# Altium schematic sheet 34-SERDES AND DISPLAY INTERFACE.SchDoc
size 513 x 386 mm
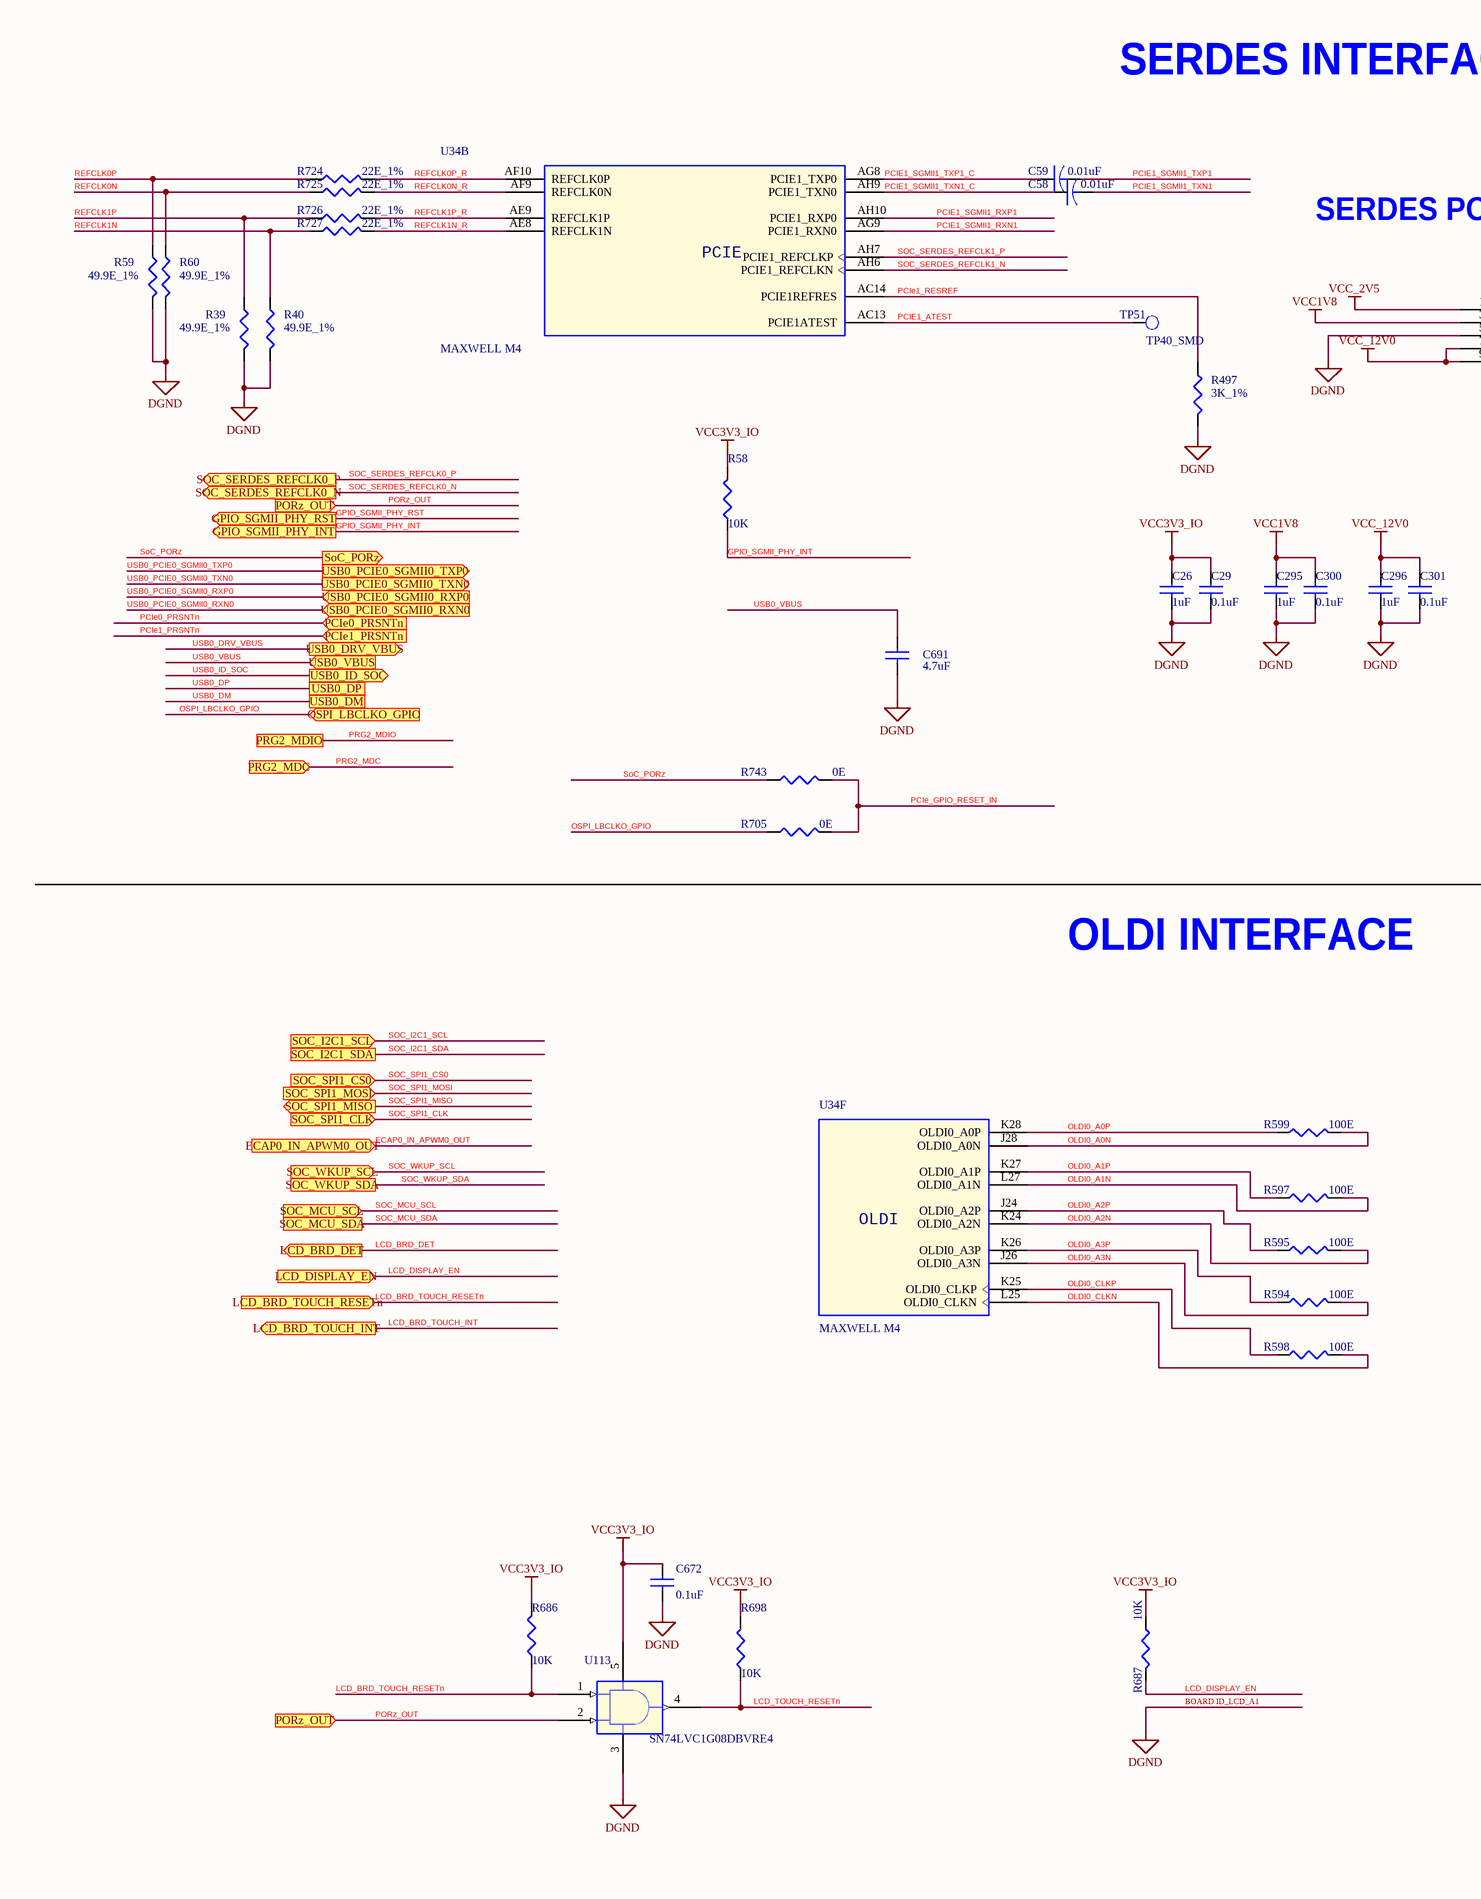
[diagram p0: 34-SERDES AND DISPLAY INTERFACE.SchDoc, left]
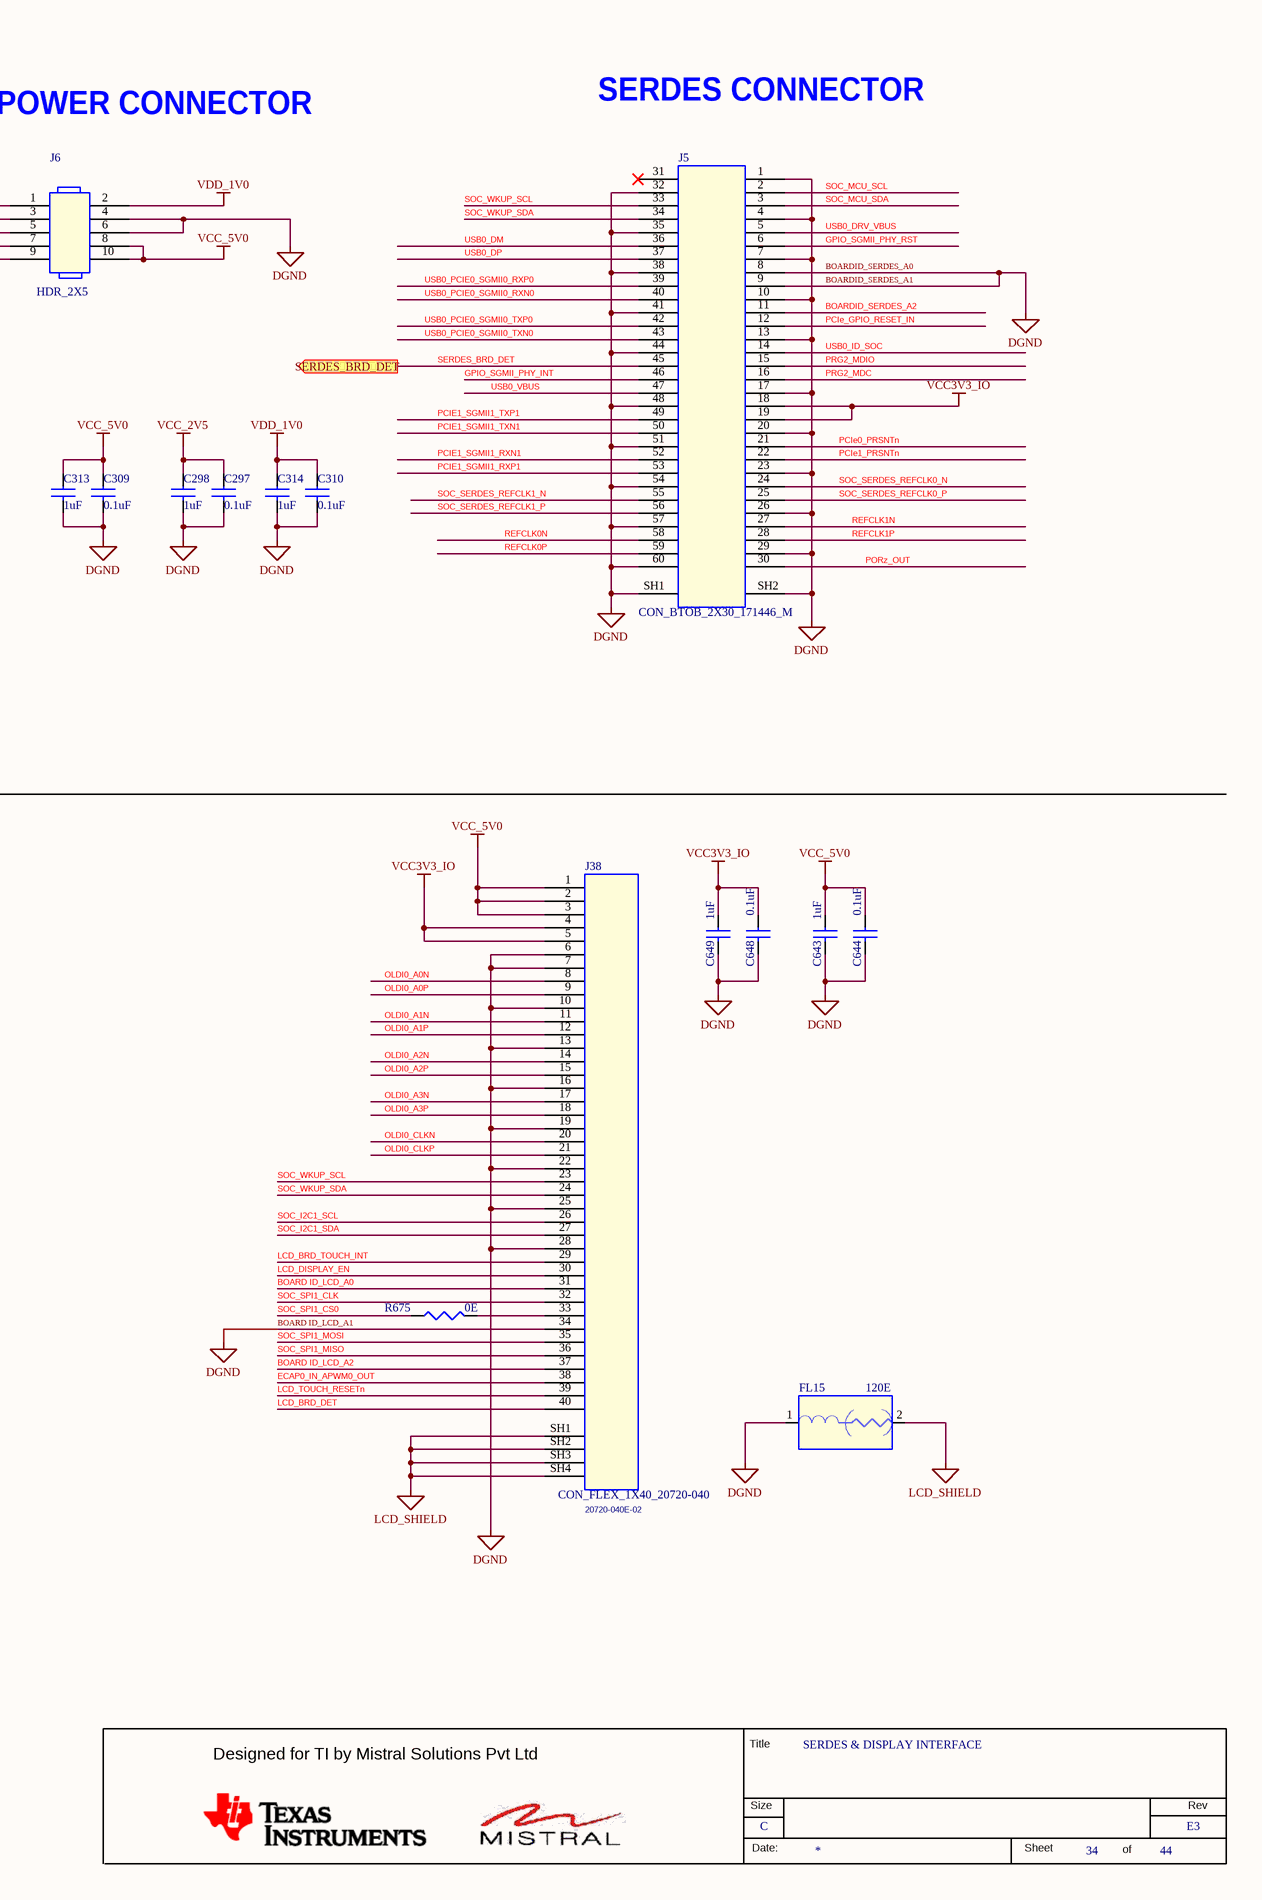
[diagram p1: 34-SERDES AND DISPLAY INTERFACE.SchDoc, right]

## Parts
*  RevCode: E3  Title: SERDES & DISPLAY INTERFACE  Page Size: C  Page Number: 34  Page Count: 44  (hidden comment: MISTRAL_TITLEBLK_CSIZE)  (graphical)
C26  1uF  [CAP0402_0-75]
C29  0.1uF  [CAP0201_0-5]
C58  0.01uF  [CAP0402_0-75]
C59  0.01uF  [CAP0402_0-75]
C295  1uF  [CAP0402_0-75]
C296  1uF  [CAP0402_0-75]
C297  0.1uF  [CAP0201_0-5]
C298  1uF  [CAP0402_0-75]
C300  0.1uF  [CAP0201_0-5]
C301  0.1uF  [CAP0201_0-5]
C309  0.1uF  [CAP0201_0-5]
C310  0.1uF  [CAP0201_0-5]
C313  1uF  [CAP0402_0-75]
C314  1uF  [CAP0402_0-75]
C643  1uF  [CAP0402_0-75]
C644  0.1uF  [CAP0201_0-5]
C648  0.1uF  [CAP0201_0-5]
C649  1uF  [CAP0402_0-75]
C672  0.1uF  [CAP0201_0-5]
C691  4.7uF  [CAP0402_0-75]
FL15  120E  [EMIFIL_BLM15A_0402_0-6]
J5  CON_BTOB_2X30_171446_M  [CON_BTOB2X30_171446_P_S_S_5-5]
J6  HDR_2X5  [HDR_2X5_TFC-105-01-D-A_S_T_5-6]
J38  CON_FLEX_1X40_20720-040  Mfr_part_number: 20720-040E-02  [CON_FLEX1X40_20720-040_S_R_S_2]
R39  49.9E_1%  [RES0201]
R40  49.9E_1%  [RES0201]
R58  10K  [RES0402_0-5]
R59  49.9E_1%  [RES0201]
R60  49.9E_1%  [RES0201]
R497  3K_1%  [RES0402_0-5]
R594  100E  [RES0201]
R595  100E  [RES0201]
R597  100E  [RES0201]
R598  100E  [RES0201]
R599  100E  [RES0201]
R675  0E  [RES0402_0-5]
R686  10K  [RES0402_0-5]
R687  10K  [RES0402_0-5]
R698  10K  [RES0402_0-5]
R705  0E  [RES0402_0-5]
R724  22E_1%  [RES0402]
R725  22E_1%  [RES0402]
R726  22E_1%  [RES0402]
R727  22E_1%  [RES0402]
R743  0E  [RES0402_0-5]
TP51  TP40_SMD  [TP40_SMD]
U34  MAXWELL M4  [BGA784_31-49_910X910_1-7]  (parts B,F of 19)
U113  SN74LVC1G08DBVRE4  [SOT23-5]

## Ports
ECAP0_IN_APWM0_OUT (in), GPIO_SGMII_PHY_INT (out), GPIO_SGMII_PHY_RST (out), LCD_BRD_DET (out), LCD_BRD_TOUCH_INT (out), LCD_BRD_TOUCH_RESETn (in), LCD_DISPLAY_EN (in), OSPI_LBCLKO_GPIO (in), PCIe0_PRSNTn (in), PCIe1_PRSNTn (in), PORz_OUT (in), PRG2_MDC (in), PRG2_MDIO, SERDES_BRD_DET (out), SOC_I2C1_SCL (in), SOC_I2C1_SDA, SOC_MCU_SCL (in), SOC_MCU_SDA, SoC_PORz (out), SOC_SERDES_REFCLK0_N (out), SOC_SERDES_REFCLK0_P (out), SOC_SPI1_CLK (in), SOC_SPI1_CS0 (in), SOC_SPI1_MISO (out), SOC_SPI1_MOSI (in), SOC_WKUP_SCL (in), SOC_WKUP_SDA, USB0_DM, USB0_DP, USB0_DRV_VBUS (out), USB0_ID_SOC (out), USB0_PCIE0_SGMII0_RXN0 (in), USB0_PCIE0_SGMII0_RXP0 (in), USB0_PCIE0_SGMII0_TXN0 (out), USB0_PCIE0_SGMII0_TXP0 (out), USB0_VBUS (in)

## Nets
DGND: C26.2 C29.2 C295.2 C296.2 C297.2 C298.2 C300.2 C301.2 C309.2 C310.2 C313.2 C314.2 C643.2 C644.2 C648.2 C649.2 C672.2 C691.2 FL15.1 J5.1 J5.4 J5.7 J5.8 J5.9 J5.10 J5.13 J5.17 J5.20 J5.23 J5.26 J5.29 J5.32 J5.35 J5.38 J5.41 J5.44 J5.48 J5.51 J5.54 J5.57 J5.60 J5.SH1 J5.SH2 J6.4 J6.5 J6.6 J38.6 J38.7 J38.10 J38.13 J38.16 J38.19 J38.22 J38.25 J38.28 J38.34 R39.2 R40.2 R59.2 R60.2 R497.2 U113.3(GND)
LCD_SHIELD: FL15.2 J38.SH1 J38.SH2 J38.SH3 J38.SH4
VCC1V8: C295.1 C300.1 J6.3
VCC3V3_IO: C26.1 C29.1 C648.1 C649.1 C672.1 J5.18 J5.19 J38.4 J38.5 R58.2 R686.2 R687.1 R698.2 U113.5(VCC)
VCC_2V5: C297.1 C298.1 J6.1
VCC_5V0: C309.1 C313.1 C643.1 C644.1 J6.8 J6.10 J38.1 J38.2 J38.3
VCC_12V0: C296.1 C301.1 J6.7 J6.9
VDD_1V0: C310.1 C314.1 J6.2
BOARD ID_LCD_A0: J38.31
BOARD ID_LCD_A2: J38.37
BOARDID_SERDES_A2: J5.11
ECAP0_IN_APWM0_OUT: J38.38 ; port ECAP0_IN_APWM0_OUT
GPIO_SGMII_PHY_INT: J5.46 R58.1 ; port GPIO_SGMII_PHY_INT
GPIO_SGMII_PHY_RST: J5.6 ; port GPIO_SGMII_PHY_RST
LCD_BRD_DET: J38.40 ; port LCD_BRD_DET
LCD_BRD_TOUCH_INT: J38.29 ; port LCD_BRD_TOUCH_INT
LCD_BRD_TOUCH_RESETn: R686.1 U113.1(A) ; port LCD_BRD_TOUCH_RESETn
LCD_DISPLAY_EN: J38.30 R687.2 ; port LCD_DISPLAY_EN
LCD_TOUCH_RESETn: J38.39 R698.1 U113.4(Y)
OLDI0_A0N: J38.8 R599.2 U34.J28(OLDI0_A0N)
OLDI0_A0P: J38.9 R599.1 U34.K28(OLDI0_A0P)
OLDI0_A1N: J38.11 R597.2 U34.L27(OLDI0_A1N)
OLDI0_A1P: J38.12 R597.1 U34.K27(OLDI0_A1P)
OLDI0_A2N: J38.14 R595.2 U34.K24(OLDI0_A2N)
OLDI0_A2P: J38.15 R595.1 U34.J24(OLDI0_A2P)
OLDI0_A3N: J38.17 R594.2 U34.J26(OLDI0_A3N)
OLDI0_A3P: J38.18 R594.1 U34.K26(OLDI0_A3P)
OLDI0_CLKN: J38.20 R598.2 U34.L25(OLDI0_CLKN)
OLDI0_CLKP: J38.21 R598.1 U34.K25(OLDI0_CLKP)
OSPI_LBCLKO_GPIO: R705.2 ; port OSPI_LBCLKO_GPIO
PCIe0_PRSNTn: J5.21 ; port PCIe0_PRSNTn
PCIE1_ATEST: TP51.1(TP) U34.AC13(PCIE1ATEST)
PCIe1_PRSNTn: J5.22 ; port PCIe1_PRSNTn
PCIe1_RESREF: R497.1 U34.AC14(PCIE1REFRES)
PCIE1_SGMII1_RXN1: J5.52 U34.AG9(PCIE1_RXN0)
PCIE1_SGMII1_RXP1: J5.53 U34.AH10(PCIE1_RXP0)
PCIE1_SGMII1_TXN1: C58.2 J5.50
PCIE1_SGMII1_TXN1_C: C58.1 U34.AH9(PCIE1_TXN0)
PCIE1_SGMII1_TXP1: C59.2 J5.49
PCIE1_SGMII1_TXP1_C: C59.1 U34.AG8(PCIE1_TXP0)
PCIe_GPIO_RESET_IN: J5.12 R705.1 R743.1
PORz_OUT: J5.30 U113.2(B) ; port PORz_OUT
PRG2_MDC: J5.16 ; port PRG2_MDC
PRG2_MDIO: J5.15 ; port PRG2_MDIO
REFCLK0N: J5.58 R60.1 R725.1
REFCLK0N_R: R725.2 U34.AF9(REFCLK0N)
REFCLK0P: J5.59 R59.1 R724.1
REFCLK0P_R: R724.2 U34.AF10(REFCLK0P)
REFCLK1N: J5.27 R40.1 R727.1
REFCLK1N_R: R727.2 U34.AE8(REFCLK1N)
REFCLK1P: J5.28 R39.1 R726.1
REFCLK1P_R: R726.2 U34.AE9(REFCLK1P)
SERDES_BRD_DET: J5.45 ; port SERDES_BRD_DET
SOC_I2C1_SCL: J38.26 ; port SOC_I2C1_SCL
SOC_I2C1_SDA: J38.27 ; port SOC_I2C1_SDA
SOC_MCU_SCL: J5.2 ; port SOC_MCU_SCL
SOC_MCU_SDA: J5.3 ; port SOC_MCU_SDA
SoC_PORz: R743.2 ; port SoC_PORz
SOC_SERDES_REFCLK0_N: J5.24 ; port SOC_SERDES_REFCLK0_N
SOC_SERDES_REFCLK0_P: J5.25 ; port SOC_SERDES_REFCLK0_P
SOC_SERDES_REFCLK1_N: J5.55 U34.AH6(PCIE1_REFCLKN)
SOC_SERDES_REFCLK1_P: J5.56 U34.AH7(PCIE1_REFCLKP)
SOC_SPI1_CLK: J38.32 ; port SOC_SPI1_CLK
SOC_SPI1_CS0: R675.1 ; port SOC_SPI1_CS0
SOC_SPI1_MISO: J38.36 ; port SOC_SPI1_MISO
SOC_SPI1_MOSI: J38.35 ; port SOC_SPI1_MOSI
SOC_WKUP_SCL: J5.33 J38.23 ; port SOC_WKUP_SCL
SOC_WKUP_SDA: J5.34 J38.24 ; port SOC_WKUP_SDA
USB0_DM: J5.36 ; port USB0_DM
USB0_DP: J5.37 ; port USB0_DP
USB0_DRV_VBUS: J5.5 ; port USB0_DRV_VBUS
USB0_ID_SOC: J5.14 ; port USB0_ID_SOC
USB0_PCIE0_SGMII0_RXN0: J5.40 ; port USB0_PCIE0_SGMII0_RXN0
USB0_PCIE0_SGMII0_RXP0: J5.39 ; port USB0_PCIE0_SGMII0_RXP0
USB0_PCIE0_SGMII0_TXN0: J5.43 ; port USB0_PCIE0_SGMII0_TXN0
USB0_PCIE0_SGMII0_TXP0: J5.42 ; port USB0_PCIE0_SGMII0_TXP0
USB0_VBUS: C691.1 J5.47 ; port USB0_VBUS
NetJ38_33: J38.33 R675.2

Not connected (* = marked no-connect by the designer): J5 31*

## Notes on the sheet
- SERDES INTERFACE
- SERDES POWER CONNECTOR
- SERDES CONNECTOR
- BOARDID_SERDES_A0
- BOARDID_SERDES_A1
- OLDI INTERFACE
- BOARD ID_LCD_A1
- (near R687) BOARD ID_LCD_A1
- (in symbol AM654X_BGA784, part B) PCIE
- (in symbol AM654X_BGA784, part F) OLDI
- (in symbol MISTRAL_TITLEBLK_CSIZE) Title; Designed for TI by Mistral Solutions Pvt Ltd; Size; Rev; Date:; Sheet; of

## Library data of the parts
* = MISTRAL_TITLEBLK_CSIZE: Issue: 1.0; Page Create Date: March  8, 1995; Page Modify Date: *
C26 C295 = CAP_Dup5: CAP CERAMIC 1uF 16V 20% X5R 0402; Mistral Part No: 120018020006-R; Mfr_name: TAIYO YUDEN; Mfr_part_number: EMK105BJ105MV-F; Part_type: CAPACITORS\CERAMIC; Wattage: NA; Project: TI_MAXIE_CPB; Customs_HS_Code: 85322990; Custom_Duty: 15%; Footprint Ref: CAP0402_0-75; Library Ref: CAP; MECHANICAL 3D STEP FILE: CAP0402_0-75; PCB Footprint: CAP0402_0-75; Tolerance: 20%; Voltage: 16V; Package: 0402; Distributor_name: DIGIKEY; Distributor_part_number: 587-5514-1-ND; Height: 0.55MM; Weight: 0.65mg; Temperature: -55°C+85°C; Datasheet: Y:\MIS_DATABASE\DATASHEETS\CAPACITORS\EMK105BJ105MV-F.PDF; Crtd /date: ALVY/150218; Chkd/date: MANIRAJA/150218; Library Path: Y:\MIS_DATABASE\Library\ALTIUM_TOOL\SCHEMATICS_PARTS\MS_DISCRETE_Library.schlib; Footprint Path: Y:\MIS_DATABASE\Library\ALTIUM_TOOL\PCB_FOOTPRINTS\Altium_Footprint_Lib.PcbLib
C29 C300 = CAP_Dup5: CAP CERAMIC 0.1uF 16V 10% X5R 0201; Part_type: CAPACITORS\CERAMIC; Mfr_part_number: GRM033R61C104KE84J; Mfr_name: MURATA; Mistral Part No: 120009030072-R; Custom_Duty: 15%; Customs_HS_Code: 85322990; Wattage: NA; Project: TI_MAXIE_CPB; Library Ref: CAP; PCB Footprint: CAP0201_0-5; MECHANICAL 3D STEP FILE: CAP0201_0-5; Chkd/date: MANIRAJA/120218; Crtd /date: MANIRAJA/120218; Datasheet: Y:\MIS_DATABASE\DATASHEETS\CAPACITORS\GRM033R61C104KE84.PDF; Temperature: -55°C+85°C; Weight: 0.33mg; Height: 0.33MM; Distributor_part_number: 490-16742-1-ND; Distributor_name: DIGIKEY; Package: 0201; Voltage: 16V; Tolerance: 10%
C58 = CAP: CAP CERAMIC 0.01uF 10V 10% X7R 0402; Part_type: CAPACITORS\CERAMIC; Mfr_part_number: 0402ZC103KAT2A; Mfr_name: AVX CORPORATION; Mistral Part No: 120009030017-R; Custom_Duty: 15%; Customs_HS_Code: 85322990; Wattage: NA; Project: ADR; MECHANICAL 3D STEP FILE: CAP0402_0-75; Chkd/date: VASANTHA/061216; Crtd /date: MAZHAR/201005; Datasheet: Y:\MIS_DATABASE\DATASHEETS\CAPACITORS\AVX_MLC.PDF; Temperature: -55°C+125°C; Weight: 0.65mg; Height: 0.56MM; Library Ref: CAP; Distributor_part_number: 478-7890-1-ND; Distributor_name: DIGIKEY; Package: 0402; Voltage: 10V; Tolerance: 10%; PCB Footprint: CAP0402_0-75
C59 = CAP: CAP CERAMIC 0.01uF 10V 10% X7R 0402; Mistral Part No: 120009030017-R; Mfr_name: AVX CORPORATION; Mfr_part_number: 0402ZC103KAT2A; Part_type: CAPACITORS\CERAMIC; Project: ADR; Wattage: NA; Customs_HS_Code: 85322990; Custom_Duty: 15%; Tolerance: 10%; Voltage: 10V; Package: 0402; Distributor_name: DIGIKEY; Distributor_part_number: 478-7890-1-ND; Library Ref: CAP; Height: 0.56MM; Weight: 0.65mg; Temperature: -55°C+125°C; Datasheet: Y:\MIS_DATABASE\DATASHEETS\CAPACITORS\AVX_MLC.PDF; Crtd /date: MAZHAR/201005; Chkd/date: VASANTHA/061216; MECHANICAL 3D STEP FILE: CAP0402_0-75; PCB Footprint: CAP0402_0-75
C296 C298 C313 C314 = CAP_Dup5: CAP CERAMIC 1uF 16V 20% X5R 0402; Part_type: CAPACITORS\CERAMIC; Mfr_part_number: EMK105BJ105MV-F; Mfr_name: TAIYO YUDEN; Mistral Part No: 120018020006-R; Wattage: NA; Custom_Duty: 15%; Customs_HS_Code: 85322990; Project: TI_MAXIE_CPB; Footprint Ref: CAP0402_0-75; Library Ref: CAP; MECHANICAL 3D STEP FILE: CAP0402_0-75; PCB Footprint: CAP0402_0-75; Chkd/date: MANIRAJA/150218; Crtd /date: ALVY/150218; Datasheet: Y:\MIS_DATABASE\DATASHEETS\CAPACITORS\EMK105BJ105MV-F.PDF; Temperature: -55°C+85°C; Weight: 0.65mg; Height: 0.55MM; Distributor_part_number: 587-5514-1-ND; Distributor_name: DIGIKEY; Package: 0402; Voltage: 16V; Tolerance: 20%; Library Path: Y:\MIS_DATABASE\Library\ALTIUM_TOOL\SCHEMATICS_PARTS\MS_DISCRETE_Library.schlib; Footprint Path: Y:\MIS_DATABASE\Library\ALTIUM_TOOL\PCB_FOOTPRINTS\Altium_Footprint_Lib.PcbLib
C297 C301 C309 C310 C644 C648 C672 = CAP_Dup5: CAP CERAMIC 0.1uF 16V 10% X5R 0201; Mistral Part No: 120009030072-R; Mfr_name: MURATA; Mfr_part_number: GRM033R61C104KE84J; Part_type: CAPACITORS\CERAMIC; Project: TI_MAXIE_CPB; Wattage: NA; Customs_HS_Code: 85322990; Custom_Duty: 15%; Library Ref: CAP; PCB Footprint: CAP0201_0-5; Tolerance: 10%; Voltage: 16V; Package: 0201; Distributor_name: DIGIKEY; Distributor_part_number: 490-16742-1-ND; Height: 0.33MM; Weight: 0.33mg; Temperature: -55°C+85°C; Datasheet: Y:\MIS_DATABASE\DATASHEETS\CAPACITORS\GRM033R61C104KE84.PDF; Crtd /date: MANIRAJA/120218; Chkd/date: MANIRAJA/120218; MECHANICAL 3D STEP FILE: CAP0201_0-5
C643 = CAP_Dup5: CAP CERAMIC 1uF 16V 20% X5R 0402; Part_type: CAPACITORS\CERAMIC; Mfr_part_number: EMK105BJ105MV-F; Mfr_name: TAIYO YUDEN; Mistral Part No: 120018020006-R; Custom_Duty: 15%; Customs_HS_Code: 85322990; Wattage: NA; Project: TI_MAXIE_CPB; Footprint Ref: CAP0402_0-75; Library Ref: CAP; PCB Footprint: CAP0402_0-75; MECHANICAL 3D STEP FILE: CAP0402_0-75; Chkd/date: MANIRAJA/150218; Crtd /date: ALVY/150218; Datasheet: Y:\MIS_DATABASE\DATASHEETS\CAPACITORS\EMK105BJ105MV-F.PDF; Temperature: -55°C+85°C; Weight: 0.65mg; Height: 0.55MM; Distributor_part_number: 587-5514-1-ND; Distributor_name: DIGIKEY; Package: 0402; Voltage: 16V; Tolerance: 20%; Library Path: Y:\MIS_DATABASE\Library\ALTIUM_TOOL\SCHEMATICS_PARTS\MS_DISCRETE_Library.schlib; Footprint Path: Y:\MIS_DATABASE\Library\ALTIUM_TOOL\PCB_FOOTPRINTS\Altium_Footprint_Lib.PcbLib
C649 = CAP_Dup5: CAP CERAMIC 1uF 16V 20% X5R 0402; Mistral Part No: 120018020006-R; Mfr_name: TAIYO YUDEN; Mfr_part_number: EMK105BJ105MV-F; Part_type: CAPACITORS\CERAMIC; Project: TI_MAXIE_CPB; Wattage: NA; Customs_HS_Code: 85322990; Custom_Duty: 15%; Footprint Ref: CAP0402_0-75; Library Ref: CAP; PCB Footprint: CAP0402_0-75; Tolerance: 20%; Voltage: 16V; Package: 0402; Distributor_name: DIGIKEY; Distributor_part_number: 587-5514-1-ND; Height: 0.55MM; Weight: 0.65mg; Temperature: -55°C+85°C; Datasheet: Y:\MIS_DATABASE\DATASHEETS\CAPACITORS\EMK105BJ105MV-F.PDF; Crtd /date: ALVY/150218; Chkd/date: MANIRAJA/150218; MECHANICAL 3D STEP FILE: CAP0402_0-75; Library Path: Y:\MIS_DATABASE\Library\ALTIUM_TOOL\SCHEMATICS_PARTS\MS_DISCRETE_Library.schlib; Footprint Path: Y:\MIS_DATABASE\Library\ALTIUM_TOOL\PCB_FOOTPRINTS\Altium_Footprint_Lib.PcbLib
C691 = CAP_Dup5: CAP CERAMIC 4.7uF 10V 20% X5R 0402; Part_type: CAPACITORS\CERAMIC; Mfr_part_number: 0402ZD475MAT2A; Mfr_name: AVX CORPORATION; Mistral Part No: 120012060002-R; Custom_Duty: 15%; Customs_HS_Code: 85322990; Wattage: NA; Project: TI_MAXIE_CPB; PCB Footprint: CAP0402_0-75; Library Ref: CAP; MECHANICAL 3D STEP FILE: CAP0402_0-75; Chkd/date: MANIRAJA/230118; Crtd /date: MANIRAJA/230118; Datasheet: Y:\MIS_DATABASE\DATASHEETS\CAPACITORS\AVX_MLC.PDF; Temperature: -55°C+85°C; Weight: 0.65mg; Height: 0.71MM; Distributor_part_number: 478-10791-1-ND; Distributor_name: DIGIKEY; Package: 0402; Voltage: 10V; Tolerance: 20%
FL15 = EMIFILTER_IND: FERRITE CHIP 120E 1.3A 0402; Part_type: MISC\FILTER; Mfr_part_number: BLM15PD121SN1; Mfr_name: MURATA; Mistral Part No: 130012030043-R; Custom_Duty: 24%; Customs_HS_Code: 85437099; Wattage: NA; Tolerance: 25%; Project: GEN_3-8; Footprint Path: Y:\MIS_DATABASE\Library\ALTIUM_TOOL\PCB_FOOTPRINTS\Altium_Footprint_Lib.PcbLib; Library Path: Y:\MIS_DATABASE\Library\ALTIUM_TOOL\SCHEMATICS_PARTS\MS_FILTER_Library.schlib; Footprint Ref: EMIFIL_BLM15A_0402_0-6; Library Ref: EMIFILTER_IND; PCB Footprint: EMIFIL_BLM15A_0402_0-6; MECHANICAL 3D STEP FILE: EMIFIL_BLM15A_0402_0-6; Chkd/date: VASANTHA/010117; Crtd /date: CHAITHANYA/150312; Datasheet: Y:\MIS_DATABASE\DATASHEETS\DISCRETES\INDUCTORS\BLM18K-SERIES.PDF; Temperature: -55°C+125°C; Weight: 0.65mg; Height: 0.55MM; Distributor_part_number: 490-5203-1-ND; Distributor_name: DIGIKEY; Package: 0402; Voltage: NA
J5 = CON_BTOB_30X2_171446: CON BTOB 2X30 0.80MM PITCH MALE ST SMD; Part_type: CONNECTOR\BTOB; Mfr_part_number: 171446-1114; Mfr_name: MOLEX; Mistral Part No: 150017100005-R; Custom_Duty: 24%; Customs_HS_Code: 85369090; Wattage: NA; Project: TI_MAXIE_CPB; Library Ref: CON_BTOB_30X2_171446; MECHANICAL 3D STEP FILE: CON_BTOB2X30_171446_P_S_S_5-5; Chkd/date: MANIRAJA/051017; Crtd /date: MANIRAJA/051017; Datasheet: Y:\MIS_DATABASE\DATASHEETS\CONNECTORS\171446-SER.PDF; Temperature: -40°C+105°C; Weight: 526mg; Height: 5.50MM; Distributor_part_number: 1714461114-ND; Distributor_name: DIGIKEY; Package: SMD; Voltage: NA; Tolerance: NA; PCB Footprint: CON_BTOB2X30_171446_P_S_S_5-5
J6 = HEADER_5X2: CON HDR 2X5 1.27MM PITCH ST TH; Part_type: CONNECTOR\HEADERS; Mfr_part_number: TFC-105-01-L-D-A; Mfr_name: SAMTEC; Mistral Part No: 150017100027-R; Custom_Duty: 24%; Customs_HS_Code: 85369090; Wattage: NA; Project: TI_MAXIE_CPB; Library Ref: HEADER_5X2; MECHANICAL 3D STEP FILE: HDR_2X5_TFC-105-01-D-A_S_T_5-6; Chkd/date: VASANTHA/181017; Crtd /date: VASANTHA/181017; Datasheet: Y:\MIS_DATABASE\DATASHEETS\CONNECTORS\TFC-TH-SERIES.PDF; Temperature: -55°C+125°C; Weight: NA; Height: 5.59MM; Distributor_part_number: NA; Distributor_name: NA; Package: THRU-HOLE; Voltage: NA; Tolerance: NA; PCB Footprint: HDR_2X5_TFC-105-01-D-A_S_T_5-6
J38 = CON_FLEX_40X1_SH4: CON FPC 1X40 0.50MM PITCH RT SMD; Mistral Part No: 150017100021-R; Mfr_name: IPEX; Part_type: CONNECTOR\FPC; Project: TI_MAXIE_CPB; Tolerance: NA; Customs_HS_Code: 85369090; Custom_Duty: 24%; Library Ref: CON_FLEX_40X1_SH4; PCB Footprint: CON_FLEX1X40_20720-040_S_R_S_2; Voltage: NA; Wattage: NA; Package: SMD; Distributor_name: NA; Distributor_part_number: NA; Height: 2.00MM; Weight: NA; Temperature: -40°C+105°C; Datasheet: Y:\MIS_DATABASE\DATASHEETS\CONNECTORS\20720-0XX.PDF; Crtd /date: MANIRAJA/121017; Chkd/date: MANIRAJA/121017; MECHANICAL 3D STEP FILE: CON_FLEX1X40_20720-040_S_R_S_2
R39 R40 R59 R60 = RESISTOR_Dup5: RES 49.9E 1/20W 1% 0201; Part_type: RESISTORS\FIXED; Mfr_part_number: ERJ-1GEF49R9C; Mfr_name: PANASONIC-ECG; Mistral Part No: 110009030893-R; Custom_Duty: 15%; Customs_HS_Code: 85332119; Project: V8TS; Footprint Path: Y:\MIS_DATABASE\Library\ALTIUM_TOOL\PCB_FOOTPRINTS\Altium_Footprint_Lib.PcbLib; Library Path: Y:\MIS_DATABASE\Library\ALTIUM_TOOL\SCHEMATICS_PARTS\MS_DISCRETE_Library.schlib; Chkd/date: MAZHAR/140709; Crtd /date: MAZHAR/300807; Datasheet: Y:\MIS_DATABASE\DATASHEETS\RESISTORS\ERJ-1G.PDF; Height: 0.26MM; Distributor_part_number: P49.9ABCT-ND; Distributor_name: DIGIKEY; Package: 0201; Wattage: 1/20W; Tolerance: 1%; Library Ref: RESISTOR; PCB Footprint: RES0201
R58 R686 R698 = RESISTOR_Dup5: RES 10K 1/16W 5% 0402; Part_type: RESISTORS\FIXED; Mfr_part_number: RC0402JR-0710KL; Mfr_name: YAGEO AMERICA; Mistral Part No: 110009030208-R; Custom_Duty: 15%; Customs_HS_Code: 85332119; Voltage: NA; Project: HSE; Footprint Path: Y:\MIS_DATABASE\Library\ALTIUM_TOOL\PCB_FOOTPRINTS\Altium_Footprint_Lib.PcbLib; Library Path: Y:\MIS_DATABASE\Library\ALTIUM_TOOL\SCHEMATICS_PARTS\MS_DISCRETE_Library.schlib; Footprint Ref: RES0402_0-5; Library Ref: RESISTOR; PCB Footprint: RES0402_0-5; MECHANICAL 3D STEP FILE: RES0402_0-5; RoHS: Pb-Free; Chkd/date: VASANTHA/061216; Crtd /date: MAZHAR/230805; Datasheet: Y:\MIS_DATABASE\DATASHEETS\RESISTORS\YAGEO-RC0402.PDF; Temperature: -55°C+155°C; Weight: 0.65mg; Height: 0.40MM; Distributor_part_number: 311-10KJRCT-ND; Distributor_name: DIGIKEY; Package: 0402; Wattage: 1/16W; Tolerance: 5%
R497 = RESISTOR_Dup5: RES 3K 1/16W 1% 0402; Part_type: RESISTORS\FIXED; Mfr_part_number: RC0402FR-073KL; Mfr_name: YAGEO AMERICA; Mistral Part No: 110017110004-R; Custom_Duty: 15%; Customs_HS_Code: 85332119; Voltage: NA; Project: TI_SVB_MAXWELL_DUT; Library Ref: RESISTOR; MECHANICAL 3D STEP FILE: RES0402_0-5; Chkd/date: MANIRAJA/101117; Crtd /date: MANIRAJA/101117; Datasheet: Y:\MIS_DATABASE\DATASHEETS\RESISTORS\YAGEO.PDF; Temperature: -55°C+155°C; Weight: 0.65mg; Height: 0.40MM; Distributor_part_number: 311-3KLRCT-ND; Distributor_name: DIGIKEY; Package: 0402; Wattage: 1/16W; Tolerance: 1%; PCB Footprint: RES0402_0-5
R594 R597 R599 = RESISTOR: RES 100E 1/20W 5% 0201; Part_type: RESISTORS\FIXED; Mfr_part_number: NRC02J101TRF; Mfr_name: NIC COMPONENTS; Mistral Part No: 110010070060-R; Custom_Duty: 15%; Customs_HS_Code: 85332119; Voltage: 50V; Project: PB_BUGBASE; NI_MARK: DNI; Library Ref: RESISTOR; PCB Footprint: RES0201; Chkd/date: SUHAS/280910; Crtd /date: MUDDU/100710; Datasheet: Y:\MIS_DATABASE\DATASHEETS\RESISTORS\NRC SERIES.PDF; Temperature: -55°C+125°C; Weight: NA; Height: 0.30MM; Distributor_part_number: NA; Distributor_name: NA; Package: 0201; Wattage: 1/20W; Tolerance: 5%
R595 R598 = RESISTOR: RES 100E 1/20W 5% 0201; Mistral Part No: 110010070060-R; Mfr_name: NIC COMPONENTS; Mfr_part_number: NRC02J101TRF; Part_type: RESISTORS\FIXED; Project: PB_BUGBASE; Voltage: 50V; Customs_HS_Code: 85332119; Custom_Duty: 15%; NI_MARK: DNI; Library Ref: RESISTOR; PCB Footprint: RES0201; Tolerance: 5%; Wattage: 1/20W; Package: 0201; Distributor_name: NA; Distributor_part_number: NA; Height: 0.30MM; Weight: NA; Temperature: -55°C+125°C; Datasheet: Y:\MIS_DATABASE\DATASHEETS\RESISTORS\NRC SERIES.PDF; Crtd /date: MUDDU/100710; Chkd/date: SUHAS/280910
R675 = RESISTOR_Dup5: RES 0E 1/16W 0402; Mistral Part No: 110010080019-P; Mfr_name: VISHAY; Mfr_part_number: CRCW04020000Z0ED; Part_type: RESISTORS\FIXED; Project: PB_BUGBASE; Tolerance: NA; Customs_HS_Code: 85332119; Custom_Duty: 15%; Footprint Path: Y:\MIS_DATABASE\Library\ALTIUM_TOOL\PCB_FOOTPRINTS\Altium_Footprint_Lib.PcbLib; Library Path: Y:\MIS_DATABASE\Library\ALTIUM_TOOL\SCHEMATICS_PARTS\MS_DISCRETE_Library.schlib; Footprint Ref: RES0402_0-5; Library Ref: RESISTOR; PCB Footprint: RES0402_0-5; Voltage: NA; Wattage: 1/16W; Package: 0402; Distributor_name: DIGIKEY; Distributor_part_number: 541-0.0JCT-ND; Height: 0.40MM; Weight: 0.65g/1000pcs; Temperature: -55°C+155°C; Datasheet: Y:\MIS_DATABASE\DATASHEETS\RESISTORS\CRCW0603.PDF; Crtd /date: MUDDU/190810; Chkd/date: VASANTHA/201216; RoHS: Pb-Free; MECHANICAL 3D STEP FILE: RES0402_0-5
R687 = RESISTOR_Dup5: RES 10K 1/16W 5% 0402; Part_type: RESISTORS\FIXED; Mfr_part_number: RC0402JR-0710KL; Mfr_name: YAGEO AMERICA; Mistral Part No: 110009030208-R; Custom_Duty: 15%; Customs_HS_Code: 85332119; Voltage: NA; Project: HSE; NI_MARK: DNI; Footprint Path: Y:\MIS_DATABASE\Library\ALTIUM_TOOL\PCB_FOOTPRINTS\Altium_Footprint_Lib.PcbLib; Library Path: Y:\MIS_DATABASE\Library\ALTIUM_TOOL\SCHEMATICS_PARTS\MS_DISCRETE_Library.schlib; Footprint Ref: RES0402_0-5; Library Ref: RESISTOR; MECHANICAL 3D STEP FILE: RES0402_0-5; RoHS: Pb-Free; Chkd/date: VASANTHA/061216; Crtd /date: MAZHAR/230805; Datasheet: Y:\MIS_DATABASE\DATASHEETS\RESISTORS\YAGEO-RC0402.PDF; Temperature: -55°C+155°C; Weight: 0.65mg; Height: 0.40MM; Distributor_part_number: 311-10KJRCT-ND; Distributor_name: DIGIKEY; Package: 0402; Wattage: 1/16W; Tolerance: 5%; PCB Footprint: RES0402_0-5
R705 = RESISTOR_Dup4: RES 0E 1/16W 0402; Mistral Part No: 110010080019-P; Mfr_name: VISHAY; Mfr_part_number: CRCW04020000Z0ED; Part_type: RESISTORS\FIXED; Project: PB_BUGBASE; Tolerance: NA; Customs_HS_Code: 85332119; Custom_Duty: 15%; NI_MARK: DNI; PCB Footprint: RES0402_0-5; Footprint Path: Y:\MIS_DATABASE\Library\ALTIUM_TOOL\PCB_FOOTPRINTS\Altium_Footprint_Lib.PcbLib; Library Path: Y:\MIS_DATABASE\Library\ALTIUM_TOOL\SCHEMATICS_PARTS\MS_DISCRETE_Library.schlib; Footprint Ref: RES0402_0-5; Library Ref: RESISTOR; Voltage: NA; Wattage: 1/16W; Package: 0402; Distributor_name: DIGIKEY; Distributor_part_number: 541-0.0JCT-ND; Height: 0.40MM; Weight: 0.65g/1000pcs; Temperature: -55°C+155°C; Datasheet: Y:\MIS_DATABASE\DATASHEETS\RESISTORS\CRCW0603.PDF; Crtd /date: MUDDU/190810; Chkd/date: VASANTHA/201216; RoHS: Pb-Free; MECHANICAL 3D STEP FILE: RES0402_0-5
R724 R727 = RESISTOR_Dup5: RES 22E 1/16W 1% 0402; Mistral Part No: 110009090004-P; Mfr_name: YAGEO AMERICA; Mfr_part_number: RC0402FR-0722RL; Part_type: RESISTORS\FIXED; Alternate_mfr_name_A: VISHAY; Alternate_mfr_part_number_A: CRCW040222R0FKED; Cust_part_number: 4700-80047E; Project: VMEFMCD; Voltage: 50V; Customs_HS_Code: 85332119; Custom_Duty: 15%; Remarks: In alternate datasheet it is RoHS COMPLIANT. Y:\MIS_DATABASE\DATASHEETS\RESISTORS\CRCW0402.PDF; Library Ref: RESISTOR; Tolerance: 1%; Wattage: 1/16W; Package: 0402; Distributor_name: DIGIKEY; Distributor_part_number: 311-22.0LRCT-ND; Distributor_name_A: DIGIKEY; Distributor_part_number_A: 541-22.0LCT-ND; Height: 0.40MM; Weight: 0.8g/1000pcs; Temperature: -55°C+155°C; Datasheet: Y:\MIS_DATABASE\DATASHEETS\RESISTORS\YAGEO-RC0402.PDF; Crtd /date: MAZHAR/090909; Chkd/date: SUHAS/290910; RoHS: Pb-Free; PCB Footprint: RES0402
R725 R726 = RESISTOR_Dup5: RES 22E 1/16W 1% 0402; Cust_part_number: 4700-80047E; Alternate_mfr_part_number_A: CRCW040222R0FKED; Alternate_mfr_name_A: VISHAY; Part_type: RESISTORS\FIXED; Mfr_part_number: RC0402FR-0722RL; Mfr_name: YAGEO AMERICA; Mistral Part No: 110009090004-P; Remarks: In alternate datasheet it is RoHS COMPLIANT. Y:\MIS_DATABASE\DATASHEETS\RESISTORS\CRCW0402.PDF; Custom_Duty: 15%; Customs_HS_Code: 85332119; Voltage: 50V; Project: VMEFMCD; Library Ref: RESISTOR; RoHS: Pb-Free; Chkd/date: SUHAS/290910; Crtd /date: MAZHAR/090909; Datasheet: Y:\MIS_DATABASE\DATASHEETS\RESISTORS\YAGEO-RC0402.PDF; Temperature: -55°C+155°C; Weight: 0.8g/1000pcs; Height: 0.40MM; Distributor_part_number_A: 541-22.0LCT-ND; Distributor_name_A: DIGIKEY; Distributor_part_number: 311-22.0LRCT-ND; Distributor_name: DIGIKEY; Package: 0402; Wattage: 1/16W; Tolerance: 1%; PCB Footprint: RES0402
R743 = RESISTOR_Dup4: RES 0E 1/16W 0402; Mistral Part No: 110010080019-P; Mfr_name: VISHAY; Mfr_part_number: CRCW04020000Z0ED; Part_type: RESISTORS\FIXED; Project: PB_BUGBASE; Tolerance: NA; Customs_HS_Code: 85332119; Custom_Duty: 15%; PCB Footprint: RES0402_0-5; MECHANICAL 3D STEP FILE: RES0402_0-5; Voltage: NA; Wattage: 1/16W; Package: 0402; Distributor_name: DIGIKEY; Distributor_part_number: 541-0.0JCT-ND; Height: 0.40MM; Weight: 0.65g/1000pcs; Temperature: -55°C+155°C; Datasheet: Y:\MIS_DATABASE\DATASHEETS\RESISTORS\CRCW0603.PDF; Crtd /date: MUDDU/190810; Chkd/date: VASANTHA/201216; RoHS: Pb-Free; Library Ref: RESISTOR; Footprint Ref: RES0402_0-5; Library Path: Y:\MIS_DATABASE\Library\ALTIUM_TOOL\SCHEMATICS_PARTS\MS_DISCRETE_Library.schlib; Footprint Path: Y:\MIS_DATABASE\Library\ALTIUM_TOOL\PCB_FOOTPRINTS\Altium_Footprint_Lib.PcbLib
TP51 = TESTPOINT: TESTPOINT CIR 40 SMD; Mfr_name: LOCAL; Mistral Part No: 130009030933; Project: RAINIER-3; Tolerance: NA; NI_MARK: DNI; RoHS: NA; Footprint Ref: TP40_SMD; Library Ref: TESTPOINT; Chkd/date: MAZHAR/190505; Crtd /date: MAZHAR/190505; Height: NA; Distributor_part_number: NA; Distributor_name: NA; Package: SMD; Part_type: TESTPOINT; Mfr_part_number: TP40_SMD; Voltage: NA; Wattage: NA; Weight: NA; Temperature: NA; Datasheet: NA; MECHANICAL 3D STEP FILE: NA; Library Path: Y:\MIS_DATABASE\Library\ALTIUM_TOOL\SCHEMATICS_PARTS\MS_DISCRETE_Library.schlib; Footprint Path: Y:\MIS_DATABASE\Library\ALTIUM_TOOL\PCB_FOOTPRINTS\Altium_Footprint_Lib.PcbLib; PCB Footprint: TP40_SMD
U34 = AM654X_BGA784: IC MAXWELL MICRO CONTROLLER UNIT BGA784; Mistral Part No: 141217100003; Mfr_name: TEXAS INSTRUMENTS; Mfr_part_number: MAXWELL M4_EVM; Part_type: ICS\DIGITAL\MICROCONTROLLER; Project: TI_MAXIE_CPB; Tolerance: NA; Customs_HS_Code: 85423100; Custom_Duty: 15%; Library Ref: AM654X_BGA784; Voltage: NA; Wattage: NA; Package: BGA784; Distributor_name: NA; Distributor_part_number: NA; Height: 1.63MM; Weight: NA; Temperature: NA; Datasheet: Y:\MIS_DATABASE\DATASHEETS\ICS\DIGITAL\MICROCONTROLLER\MAXWELLM4.PDF; Crtd /date: MANIRAJA/130717; Chkd/date: MANIRAJA/130717; MECHANICAL 3D STEP FILE: BGA784_31-49_910X910_1-7; PCB Footprint: BGA784_31-49_910X910_1-7
U113 = SN74LVC1G08DBVRE4_SOT23-5: IC SINGLE 2-INPUT POSITIVE AND GATE SOT23-5; Mistral Part No: 141009060026-R; Mfr_name: TEXAS INSTRUMENTS; Part_type: ICS\DIGITAL\GATES; Project: KHAN_MAIN; Customs_HS_Code: 85423100; Custom_Duty: 15%; Library Ref: SN74LVC1G08DBVRE4_SOT23-5; Mfr_part_number: SN74LVC1G08DBVRE4; Package: SOT23-5; Distributor_name: DIGIKEY; Distributor_part_number: SN74LVC1G08DBVRE4-ND; Height: 1.45MM; Temperature: -40°C+85°C; Datasheet: Y:\MIS_DATABASE\DATASHEETS\ICS\DIGITAL\GATES\SN74LVC1G08.PDF; Crtd /date: USMAN/151008; Chkd/date: SUHAS/221010; RoHS: Sb/ Br FREE; PCB Footprint: SOT23-5